# Altium project LASER_DRIVER_LN_HP.PrjPcb (part 4 of 4)

## Sheet ISOLATED_PS.SchDoc: AI ARTIQ Driver
size 420 x 297 mm; Author: G.Kasprowicz; CompanyName: CTI; Organization: CTI; Address1: CTI; Address2: Nowowiejska 15/19 00-665 Warsaw; Address3: gkasprow@gmail.com; DocumentNumber: 5; Revision: 1.0; SheetNumber: 5; SheetTotal: 11; ModifiedBy: -; CheckedDate: -; Title2: ISOLATED PS; DivGrp: CTI; ModifiedDate: -; ProjectName: Sensor Box
Used 2 times, as channels U_ISOLATED_PS_LN, U_ISOLATED_PS_HP. Parts and nets are listed once, with the designators drawn on the sheet.
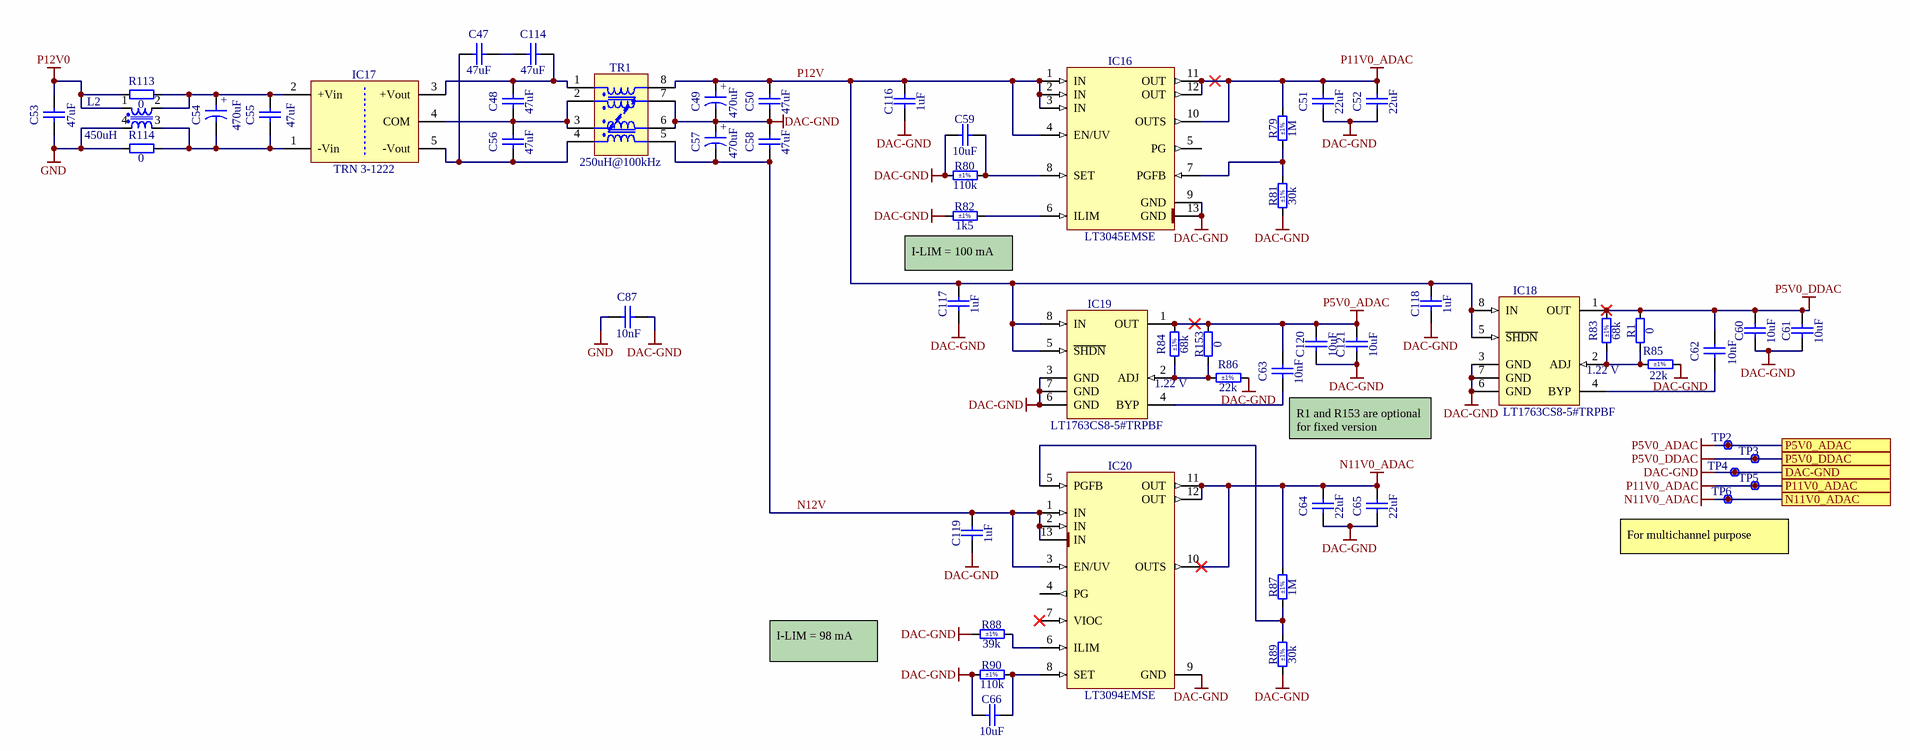
[diagram p9: ISOLATED_PS.SchDoc]

### Parts
C47  47uF  [CAPC3225X270N]
C48  47uF  [CAPC3225X270N]
C49  470uF  [CAPAE1030X1020N]
C50  47uF  [CAPC3225X270N]
C51  22uF  [CAPC3216X180N]
C52  22uF  [CAPC3216X180N]
C53  47uF  [CAPC3225X270N]
C54  470uF  [CAPAE1030X1020N]
C55  47uF  [CAPC3225X270N]
C56  47uF  [CAPC3225X270N]
C57  470uF  [CAPAE1030X1020N]
C58  47uF  [CAPC3225X270N]
C59  10uF  [CAPC2012X135N]
C60  10uF  [CAPC2012X135N]
C61  10uF  [CAPC2012X135N]
C62  10nF  [CAPC1608X87N]
C63  10nF  [CAPC1608X87N]
C64  22uF  [CAPC3216X180N]
C65  22uF  [CAPC3216X180N]
C66  10uF  [CAPC2012X135N]
C87  10nF  [CAPC1608X87N]
C114  47uF  [CAPC3225X270N]
C116  1uF  [CAPC1005X55N]
C117  1uF  [CAPC1005X55N]
C118  1uF  [CAPC1005X55N]
C119  1uF  [CAPC1005X55N]
C120  10uF  [CAPC2012X135N]
C121  10uF  [CAPC2012X135N]
IC16  LT3045EMSE  [SOP65P490X110-13N-R175X294]
IC17  TRN 3-1222  [DCDC_TRACO_TRN3]
IC18  LT1763CS8-5#TRPBF  [SOIC127P600X175-8N]
IC19  LT1763CS8-5#TRPBF  [SOIC127P600X175-8N]
IC20  LT3094EMSE  [SOP65P490X110-13N-R175X294]
L2  450uH  [CMDC-9260-6500]
R1  0  [RESC1608X55N]
R79  1M  Tolerance: ±1%  [RESC1005X40N]
R80  110k  Tolerance: ±1%  [RESC1005X40N]
R81  30k  Tolerance: ±1%  [RESC1005X40N]
R82  1k5  Tolerance: ±1%  [RESC1005X40N]
R83  68k  Tolerance: ±1%  [RESC1608X55N]
R84  68k  Tolerance: ±1%  [RESC1608X55N]
R85  22k  Tolerance: ±1%  [RESC1608X55N]
R86  22k  Tolerance: ±1%  [RESC1608X55N]
R87  1M  Tolerance: ±1%  [RESC1005X40N]
R88  39k  Tolerance: ±1%  [RESC1005X40N]
R89  30k  Tolerance: ±1%  [RESC1005X40N]
R90  110k  Tolerance: ±1%  [RESC1005X40N]
R113  0  [RESC2012X60N]
R114  0  [RESC2012X60N]
R153  0  [RESC1608X55N]
TP2  Test Point  [TPS127]  (value not drawn)  (no BOM)
TP3  Test Point  [TPS127]  (value not drawn)  (no BOM)
TP4  Test Point  [VERO_20-313145]  (value not drawn)
TP5  Test Point  [TPS127]  (value not drawn)  (no BOM)
TP6  Test Point  [TPS127]  (value not drawn)  (no BOM)
TR1  250uH@100kHz  [IND_WURTH_WE-SL_74420]

### Ports
DAC-GND, N11V0_ADAC, P5V0_ADAC, P5V0_DDAC, P11V0_ADAC

### Nets
DAC-GND: C49.2 C50.1 C51.1 C52.1 C57.1 C58.2 C59.1 C60.1 C61.1 C64.1 C65.1 C66.1 C87.2 C116.1 C117.1 C118.1 C119.1 C120.1 C121.1 IC16.9(GND) IC16.13(GND) IC18.3(GND) IC18.6(GND) IC18.7(GND) IC19.3(GND) IC19.6(GND) IC19.7(GND) IC20.9(GND) R80.1 R81.1 R82.1 R85.1 R86.1 R88.1 R89.1 R90.1 TP4.1 TR1.6 TR1.7 ; port DAC-GND
GND: C53.2 C87.1 L2.4 R114.1
N11V0_ADAC: C64.2 C65.2 IC20.10(OUTS) IC20.11(OUT) IC20.12(OUT) R87.2 TP6.1 ; port N11V0_ADAC
P5V0_ADAC: C63.2 C120.2 C121.2 IC19.1(OUT) R84.2 R153.2 TP2.1 ; port P5V0_ADAC
P5V0_DDAC: C60.2 C61.2 C62.2 IC18.1(OUT) R1.2 R83.2 TP3.1 ; port P5V0_DDAC
P11V0_ADAC: C51.2 C52.2 IC16.10(OUTS) IC16.11(OUT) IC16.12(OUT) R79.2 TP5.1 ; port P11V0_ADAC
P12V0: C53.1 L2.1 R113.1
N12V: C57.2 C58.1 C119.2 IC20.1(IN) IC20.2(IN) IC20.3(EN/UV) IC20.13(IN) TR1.5
P12V: C49.1 C50.2 C116.2 C117.2 C118.2 IC16.1(IN) IC16.2(IN) IC16.3(IN) IC16.4(EN/UV) IC18.5(~{SHDN}) IC18.8(IN) IC19.5(~{SHDN}) IC19.8(IN) TR1.8
NetC47_1: C47.1 C56.1 IC17.5(-Vout) TR1.4
NetC47_2: C47.2 C114.1
NetC48_1: C48.1 C56.2 IC17.4(COM) TR1.2 TR1.3
NetC48_2: C48.2 C114.2 IC17.3(+Vout) TR1.1(NC)
NetC54_1: C54.1 C55.1 IC17.2(+Vin) L2.2 R113.2
NetC54_2: C54.2 C55.2 IC17.1(-Vin) L2.3 R114.2
NetC59_2: C59.2 IC16.8(SET) R80.2
NetC62_1: C62.1 IC18.4(BYP)
NetC63_1: C63.1 IC19.4(BYP)
NetC66_2: C66.2 IC20.8(SET) R90.2
NetIC16_6: IC16.6(ILIM) R82.2
NetIC16_7: IC16.7(PGFB) R79.1 R81.2
NetIC18_2: IC18.2(ADJ) R1.1 R83.1 R85.2
NetIC19_2: IC19.2(ADJ) R84.1 R86.2 R153.1
NetIC20_5: IC20.5(PGFB) R87.1 R89.2
NetIC20_6: IC20.6(ILIM) R88.2

Not connected (* = marked no-connect by the designer): IC16 5(PG); IC20 4(PG) 7(VIOC)*

### Channels
U_ISOLATED_PS_LN: designators end in A; ports DAC-GND=DAC-GND N11V0_ADAC=N11V0_ADAC P5V0_ADAC=P5V0_ADAC P5V0_DDAC=P5V0_DDAC P11V0_ADAC=P11V0_ADAC
U_ISOLATED_PS_HP: designators end in B; ports DAC-GND=DAC-GND N11V0_ADAC=N11V0_ADAC P5V0_ADAC=P5V0_ADAC P5V0_DDAC=P5V0_DDAC P11V0_ADAC=P11V0_ADAC

### Notes on the sheet
- I-LIM = 100 mA
- (near IC19) 1.22 V
- (near IC18) 1.22 V
- (near C63) R1 and R153 are optional for fixed version
- For multichannel purpose
- I-LIM = 98 mA
- Project/Equipment
- Document
- Designer
- Drawn by
- Check.by
- Copyright 2018.
  This documentation describes Open Hardware and is licensed under the CERN OHL v.1.1. You may redistribute and modify this documentation under the terms of the CERN OHL v.1.1. (http://ohwr.org/CERNOHL). This documentation is distributed WITHOUT ANY EXPRESS OR IMPLIED WARRANTY, INCLUDING OF MERCHANTABILITY, SATISFACTORY QUALITY AND FITNESS FOR A PARTICULAR PURPOSE. Please see the CERN OHL v.1.1 for applicable conditions.
- Contact
- File
- Last Mod.
- Print Date
- Sheet
- Size
- A3
- of
- Rev
- (in symbol CAE1030-1020_470UF_25V_20%) +

### Library data of the parts
C47 C48 C50 C53 C55 C56 C58 C114 = CC1210_47UF_16V_20%_X5R: Non-polarised capacitor; Part Description: SMD Multilayer Chip Ceramic Capacitor; Manufacturer: GENERIC; Manufacturer1 Part Number: EMK325BJ476MM-T; Voltage: 16V; TC: X5R; Tolerance: ±20%; Part Number: CC1210_47UF_16V_20%_X5R; Component Kind: Standard; Component Type: Standard; Pin Count: 2; Value: 47uF; Status: None; Manufacturer Part Number: CC1210_47UF_16V_20%_X5R; Case: 1210; Mounted: Yes; Socket: No; SMD: Yes; Sense: No; Manufacturer1 Example: TAIYO YUDEN; Manufacturer1 ComponentHeight: 2.7mm; HelpURL: \\cern.ch\dfs\Applications\Altium\Datasheets\CC1210_X5R_TAIYO-YUDEN_HIGH-VALUE.pdf; Author: CERN DEM MR; CreateDate: 03.02.2016; LatestRevisionDate: 03.02.2016
C49 C54 C57 = CAE1030-1020_470UF_25V_20%: Polarised capacitor; Part Description: Aluminum Electrolytic SMT Capacitor; Manufacturer: PANASONIC; Manufacturer Part Number: EEEFK1E471AP; Voltage: 25V; Tolerance: ±20%; Part Number: CAE1030-1020_470UF_25V_20%; Component Kind: Standard; Component Type: Standard; Pin Count: 2; Value: 470uF; Status: Not Recommended; Case: G; Mounted: Yes; Socket: No; SMD: Yes; Sense: No; ComponentHeight: 10.2mm; HelpURL: \\cern.ch\dfs\Applications\Altium\Datasheets\CAE_PANASONIC_FK-V.pdf; Author: CERN DEM JLC; CreateDate: 03.12.2007; LatestRevisionDate: 05.11.2014
C51 C52 C64 C65 = CC1206_22UF_35V_20%_JB_TDK_C3216JB1V226M160AC: Non-polarised capacitor; Part Description: SMD Multilayer Chip Ceramic Capacitor; Manufacturer: TDK; Voltage: 35V; TC: JB(±10%); Tolerance: ±20%; Part Number: CC1206_22UF_35V_20%_JB_TDK_C3216JB1V226M160AC; Component Kind: Standard; Component Type: Standard; Pin Count: 2; Value: 22uF; Status: None; Manufacturer Part Number: C3216JB1V226M160AC; Case: 1206; Mounted: Yes; Socket: No; SMD: Yes; Sense: No; ComponentHeight: 1.8mm; HelpURL: \\cern.ch\dfs\Applications\Altium\Datasheets\CC1206_TDK_C3216JB1V226M160AC.pdf; Author: CERN DEM JLC; CreateDate: 13.07.2017; LatestRevisionDate: 13.07.2017
C59-C61 C66 C120 C121 = CC0805_10UF_16V_10%_X5R: Non-polarised capacitor; Part Description: SMD Multilayer Chip Ceramic Capacitor; Manufacturer: GENERIC; Manufacturer1 Part Number: C0805C106K4PAC; Voltage: 16V; TC: X5R; Tolerance: ±10%; Part Number: CC0805_10UF_16V_10%_X5R; Component Kind: Standard; Component Type: Standard; Pin Count: 2; Value: 10uF; Status: Preferred; Manufacturer Part Number: CC0805_10UF_16V_10%_X5R; Case: 0805; Mounted: Yes; Socket: No; SMD: Yes; Sense: No; Manufacturer1 Example: KEMET; Manufacturer1 ComponentHeight: 1.4mm; HelpURL: \\cern.ch\dfs\Applications\Altium\Datasheets\CC1206_X5R_KEMET.pdf; Author: CERN DEM JLC; CreateDate: 03.12.2007; LatestRevisionDate: 03.12.2007
C62 C63 C87 = CC0603_10NF_50V_5%_C0G: Non-polarised capacitor; Part Description: SMD Multilayer Chip Ceramic Capacitor; Manufacturer: GENERIC; Manufacturer1 Part Number: C1608C0G1H103J080AA; Voltage: 50V; TC: C0G/NP0; Tolerance: ±5%; Part Number: CC0603_10NF_50V_5%_C0G; Component Kind: Standard; Component Type: Standard; Pin Count: 2; Value: 10nF; Status: Preferred; Manufacturer Part Number: CC0603_10NF_50V_5%_C0G; Case: 0603; Mounted: Yes; Socket: No; SMD: Yes; Sense: No; Manufacturer1 Example: TDK; Manufacturer1 ComponentHeight: 0.9mm; HelpURL: \\cern.ch\dfs\Applications\Altium\Datasheets\CC0603_C0G_TDK_C.pdf; Author: CERN DEM JLC; CreateDate: 10.12.2014; LatestRevisionDate: 10.12.2014
C116-C119 = CC0402_1UF_16V_10%_X5R: Non-polarised capacitor; Part Description: SMD Multilayer Chip Ceramic Capacitor; Manufacturer: GENERIC; Manufacturer1 Part Number: C1005X5R1C105KT; Voltage: 16V; TC: X5R; Tolerance: ±10%; Part Number: CC0402_1UF_16V_10%_X5R; Component Kind: Standard; Component Type: Standard; Pin Count: 2; Value: 1uF; Status: Preferred; Manufacturer Part Number: CC0402_1UF_16V_10%_X5R; Case: 0402; Mounted: Yes; Socket: No; SMD: Yes; Sense: No; Manufacturer1 Example: TDK; Manufacturer1 ComponentHeight: 0.55mm; HelpURL: \\cern.ch\dfs\Applications\Altium\Datasheets\CC0402_X5R_TDK_C.pdf; Author: CERN DEM JLC; CreateDate: 25.10.2012; LatestRevisionDate: 25.10.2012
IC16 = LT3045EMSE: 20V, 500mA, Ultralow Noise, Ultrahigh PSRR Linear Regulator; Manufacturer: LINEAR TECHNOLOGY; PressFit: No; Bonding: No; Part Number: LT3045EMSE; Component Kind: Standard; Component Type: Standard; Device: LT3045EMSE; PackageDescription: SOP, 0.65mm Pitch; 12 Pin, 3.00mm W X 4.039mm L X 1.10mm H body (w/Thermal Tab 1.75 X 2.94 mm), IPC Medium Density; Part Description: 20V, 500mA, Ultralow Noise, Ultrahigh PSRR Linear Regulator; Manufacturer Part Number: LT3045EMSE; Pin Count: 13; Case: MSOP12; Mounted: Yes; Socket: No; SMD: Yes; Sense: No; ComponentHeight: 1.1mm; HelpURL: \\cern.ch\dfs\Applications\Altium\Datasheets\LT3045.pdf; Author: CERN DEM HF; CreateDate: 18.05.2022; LatestRevisionDate: 18.05.2022
IC17 = TRN 3-1222: TRACO, TRN 3 Serie, Dual Output DCDC Converter; Part Description: 9-18VDC to ±12V, Iout (max) ±125mA, 3W DC-DC Converter; Manufacturer: TRACO POWER; PressFit: No; Bonding: No; Part Number: TRN 3-1222; Component Kind: Standard; Component Type: Standard; Device: TRN 3-1222; PackageDescription: TRN 3 Series , Body 11.9 x 7.7mm; Manufacturer Part Number: TRN 3-1222; Pin Count: 5; Mounted: Yes; Socket: No; SMD: No; Sense: No; ComponentHeight: 11.5mm; HelpURL: \\cern.ch\dfs\Applications\Altium\Datasheets\TRN 3-1222.pdf; Author: CERN DEM JLC; CreateDate: 06.06.2017; LatestRevisionDate: 06.06.2017
IC18 IC19 = LT1763CS8: 1.22V to 20V 500mA, Low Noise, LDO Adjustable Micropower Regulator; Part Description: 1.22V to 20V, 500mA, Low Noise, LDO Adjustable Micropower Regulator; Manufacturer: LINEAR TECHNOLOGY; PressFit: No; Bonding: No; Part Number: LT1763CS8; Component Kind: Standard; Component Type: Standard; Device: LT1763CS8; PackageDescription: SOIC 8, Pitch 1.27mm, Body 4x5mm, IPC Medium Density; Manufacturer Part Number: LT1763CS8; Pin Count: 8; Case: SOIC8; Mounted: Yes; Socket: No; SMD: Yes; Sense: No; ComponentHeight: 1.75mm; HelpURL: \\cern.ch\dfs\Applications\Altium\Datasheets\LT1763CS8#PBF.pdf; Author: CERN DEM JLC; CreateDate: 11.01.2010; LatestRevisionDate: 16.03.2021
IC20 = LT3094EMSE#PBF: -20V, 500mA, Ultralow Noise, Ultrahigh PSRR Negative Linear Regulator; Manufacturer: LINEAR TECHNOLOGY; PressFit: No; Bonding: No; Part Number: LT3094EMSE#PBF; Component Kind: Standard; Component Type: Standard; Device: LT3094EMSE; PackageDescription: SOP, 0.65mm Pitch; 12 Pin, 3.00mm W X 4.039mm L X 1.10mm H body (w/Thermal Tab 1.75 X 2.94 mm), IPC Medium Density; Part Description: -20V, 500mA, Ultralow Noise, Ultrahigh PSRR Negative Linear Regulator; Manufacturer Part Number: LT3094EMSE#PBF; Pin Count: 13; Case: MSOP12; Mounted: Yes; Socket: No; SMD: Yes; Sense: No; ComponentHeight: 1.1mm; HelpURL: \\cern.ch\dfs\Applications\Altium\Datasheets\LT3094EMSE#PBF.pdf; Author: CERN DEM JLC; CreateDate: 12.11.2018; LatestRevisionDate: 12.11.2018
L2 = IND_450UH_35%_TRACO_TCK-048: Inductor Common Mode; Part Description: Common Mode Choke TCK-048; Manufacturer: TRACO POWER; Power: 5.2A; Resistance: 0.025R; Tolerance: ±35%; Part Number: IND_450UH_35%_TRACO_TCK-048; Component Kind: Standard; Component Type: Standard; Footprint: IND_TRACO_TCK-048; Pin Count: 4; Value: 450uH; Manufacturer Part Number: TCK-048; Mounted: Yes; Socket: No; SMD: No; Sense: No; ComponentHeight: 9.8mm; HelpURL: \\cern.ch\dfs\Applications\Altium\Datasheets\IND_TRACO_TCK-048.pdf; Author: CERN DEM MR; CreateDate: 28.01.2016; LatestRevisionDate: 03.10.2019
R1 R153 = R0603_0R_JUMPER: Resistor; Part Description: 1A (0.05R Max DC Resistance) Zero Ohm Jumper; Manufacturer: GENERIC; Manufacturer1 Part Number: NRC06Z0; PressFit: No; Part Number: R0603_0R_JUMPER; Component Kind: Standard; Component Type: Standard; Pin Count: 2; Value: 0; Status: Preferred; Manufacturer Part Number: R0603_0R_JUMPER; Case: 0603; Mounted: Yes; Sense: No; Socket: No; SMD: Yes; Manufacturer1 Example: NIC COMPONENT; Manufacturer1 ComponentHeight: 0.55mm; HelpURL: \\cern.ch\dfs\Applications\Altium\Datasheets\R0603_NIC_NRC.pdf; Author: CERN DEM JLC; CreateDate: 03.12.2007; LatestRevisionDate: 13.03.2008
R79 R87 = R0402_1M_1%_0.0625W_100PPM: Resistor - 1%; Part Description: General Purpose Thick Film Chip Resistor; Manufacturer: GENERIC; Manufacturer1 Part Number: 232270671005L; TC: ±100ppm/°C; PressFit: No; Part Number: R0402_1M_1%_0.0625W_100PPM; Component Kind: Standard; Component Type: Standard; Pin Count: 2; Value: 1M; Status: Not Recommended; Power: 0.0625W; Manufacturer Part Number: R0402_1M_1%_0.0625W_100PPM; Case: 0402; Mounted: Yes; Sense: No; Socket: No; SMD: Yes; Manufacturer1 Example: YAGEO PHYCOMP; Manufacturer1 ComponentHeight: 0.4mm; HelpURL: \\cern.ch\dfs\Applications\Altium\Datasheets\R0402_Phycomp_RC0402.pdf; Author: CERN DEM JLC; CreateDate: 03.12.2007; LatestRevisionDate: 17.10.2012
R80 R90 = R0402_110K_1%_0.0625W_100PPM: Resistor - 1%; Part Description: General Purpose Thick Film Chip Resistor; Manufacturer: GENERIC; Manufacturer1 Part Number: 232270671104L; TC: ±100ppm/°C; PressFit: No; Part Number: R0402_110K_1%_0.0625W_100PPM; Component Kind: Standard; Component Type: Standard; Pin Count: 2; Value: 110k; Status: Not Recommended; Power: 0.0625W; Manufacturer Part Number: R0402_110K_1%_0.0625W_100PPM; Case: 0402; Mounted: Yes; Sense: No; Socket: No; SMD: Yes; Manufacturer1 Example: YAGEO PHYCOMP; Manufacturer1 ComponentHeight: 0.4mm; HelpURL: \\cern.ch\dfs\Applications\Altium\Datasheets\R0402_Phycomp_RC0402.pdf; Author: CERN DEM JLC; CreateDate: 03.12.2007; LatestRevisionDate: 17.10.2012
R81 R89 = R0402_30K_1%_0.0625W_100PPM: Resistor - 1%; Part Description: General Purpose Thick Film Chip Resistor; Manufacturer: GENERIC; Manufacturer1 Part Number: 232270673003L; TC: ±100ppm/°C; PressFit: No; Part Number: R0402_30K_1%_0.0625W_100PPM; Component Kind: Standard; Component Type: Standard; Pin Count: 2; Value: 30k; Status: Not Recommended; Power: 0.0625W; Manufacturer Part Number: R0402_30K_1%_0.0625W_100PPM; Case: 0402; Mounted: Yes; Sense: No; Socket: No; SMD: Yes; Manufacturer1 Example: YAGEO PHYCOMP; Manufacturer1 ComponentHeight: 0.4mm; HelpURL: \\cern.ch\dfs\Applications\Altium\Datasheets\R0402_Phycomp_RC0402.pdf; Author: CERN DEM JLC; CreateDate: 03.12.2007; LatestRevisionDate: 17.10.2012
R82 = R0402_1K5_1%_0.0625W_100PPM: Resistor - 1%; Part Description: General Purpose Thick Film Chip Resistor; Manufacturer: GENERIC; Manufacturer1 Part Number: 232270671502L; TC: ±100ppm/°C; PressFit: No; Part Number: R0402_1K5_1%_0.0625W_100PPM; Component Kind: Standard; Component Type: Standard; Pin Count: 2; Value: 1k5; Status: Not Recommended; Power: 0.0625W; Manufacturer Part Number: R0402_1K5_1%_0.0625W_100PPM; Case: 0402; Mounted: Yes; Sense: No; Socket: No; SMD: Yes; Manufacturer1 Example: YAGEO PHYCOMP; Manufacturer1 ComponentHeight: 0.4mm; HelpURL: \\cern.ch\dfs\Applications\Altium\Datasheets\R0402_Phycomp_RC0402.pdf; Author: CERN DEM JLC; CreateDate: 03.12.2007; LatestRevisionDate: 17.10.2012
R83 R84 = R0603_68K_1%_0.1W_100PPM: Resistor - 1%; Part Description: General Purpose Thick Film Chip Resistor; Manufacturer: GENERIC; Manufacturer1 Part Number: NRC06F6802TRF; Power: 0.1W; TC: ±100ppm/°C; PressFit: No; Part Number: R0603_68K_1%_0.1W_100PPM; Component Kind: Standard; Component Type: Standard; Pin Count: 2; Value: 68k; Status: Preferred; Manufacturer Part Number: R0603_68K_1%_0.1W_100PPM; Case: 0603; Mounted: Yes; Sense: No; Socket: No; SMD: Yes; Manufacturer1 Example: NIC COMPONENT; Manufacturer1 ComponentHeight: 0.55mm; HelpURL: \\cern.ch\dfs\Applications\Altium\Datasheets\R0603_NIC_NRC.pdf; Author: CERN DEM JLC; CreateDate: 03.12.2007; LatestRevisionDate: 13.03.2008
R85 R86 = R0603_22K_1%_0.1W_100PPM: Resistor - 1%; Part Description: General Purpose Thick Film Chip Resistor; Manufacturer: GENERIC; Manufacturer1 Part Number: NRC06F2202TRF; Power: 0.1W; TC: ±100ppm/°C; PressFit: No; Part Number: R0603_22K_1%_0.1W_100PPM; Component Kind: Standard; Component Type: Standard; Pin Count: 2; Value: 22k; Status: Preferred; Manufacturer Part Number: R0603_22K_1%_0.1W_100PPM; Case: 0603; Mounted: Yes; Sense: No; Socket: No; SMD: Yes; Manufacturer1 Example: NIC COMPONENT; Manufacturer1 ComponentHeight: 0.55mm; HelpURL: \\cern.ch\dfs\Applications\Altium\Datasheets\R0603_NIC_NRC.pdf; Author: CERN DEM JLC; CreateDate: 03.12.2007; LatestRevisionDate: 13.03.2008
R88 = R0402_39K_1%_0.0625W_100PPM: Resistor - 1%; Part Description: General Purpose Thick Film Chip Resistor; Manufacturer: GENERIC; Manufacturer1 Part Number: 232270673903; TC: ±100ppm/°C; PressFit: No; Part Number: R0402_39K_1%_0.0625W_100PPM; Component Kind: Standard; Component Type: Standard; Pin Count: 2; Value: 39k; Status: Not Recommended; Power: 0.0625W; Manufacturer Part Number: R0402_39K_1%_0.0625W_100PPM; Case: 0402; Mounted: Yes; Sense: No; Socket: No; SMD: Yes; Manufacturer1 Example: YAGEO PHYCOMP; Manufacturer1 ComponentHeight: 0.4mm; HelpURL: \\cern.ch\dfs\Applications\Altium\Datasheets\R0402_Phycomp_RC0402.pdf; Author: CERN DEM JLC; CreateDate: 03.12.2007; LatestRevisionDate: 17.10.2012
R113 R114 = R0805_0R_JUMPER: Resistor; Part Description: 2A (0.05R Max DC Resistance) Zero Ohm Jumper; Manufacturer: GENERIC; Manufacturer1 Part Number: NRC10Z0; PressFit: No; Part Number: R0805_0R_JUMPER; Component Kind: Standard; Component Type: Standard; Pin Count: 2; Value: 0; Status: Preferred; Manufacturer Part Number: R0805_0R_JUMPER; Case: 0805; Mounted: Yes; Sense: No; Socket: No; SMD: Yes; Manufacturer1 Example: NIC COMPONENT; Manufacturer1 ComponentHeight: 0.6mm; HelpURL: \\cern.ch\dfs\Applications\Altium\Datasheets\R0805_NIC_NRC.pdf; Author: CERN DEM JLC; CreateDate: 03.12.2007; LatestRevisionDate: 13.03.2008
TP2 TP3 TP5 TP6 = SMD_PAD_1.27X1.27MM: as TP7-TP9 on sheet Diagnostics; Part Number: SMD_PAD_1.27X1.27MM; Component Type: Standard (No BOM); Pin Count: 1; Family: Test Point; Socket: No; SMD: No; Sense: No; Status: None; ComponentHeight: 0mm; HelpURL: Undefined; Author: CERN DEM JLC; CreateDate: 12.01.2008; LatestRevisionDate: 12.01.2008; PackageDescription: 1.27mm x 1.27mm PCB Copper Area (SMD Test Point)
TP4 = VERO_20-313145: Part Description: Black Bead PCB Terminal Test Pin for 2.4mm PCB Thickness (1.32mm Hole); Manufacturer: VERO TECHNOLOGIES; PressFit: No; Part Number: VERO_20-313145; Component Kind: Standard; Component Type: Standard; Pin Count: 1; Family: Test Point; Mounted: Yes; Socket: No; SMD: No; Sense: No; Status: None; Manufacturer Part Number: 20-313145; ComponentHeight: 5.3mm; HelpURL: \\cern.ch\dfs\Applications\Altium\Datasheets\VERO_20-313145.pdf; Author: CERN DEM JLC; CreateDate: 15.07.2013; LatestRevisionDate: 15.07.2013
TR1 = IND_250UH_35%_WURTH_WE-SL_744204: Flyback Transformer; Part Description: 4 Line Common Mode Choke Surface Mount 600mA DCR(WE-SL Series); Manufacturer: WURTH ELEKTRONIK; Manufacturer Part Number: 744204; Power: 600mA; Resistance: 0.12r; Tolerance: ±35%; Part Number: IND_250UH_35%_WURTH_WE-SL_744204; Component Kind: Standard; Component Type: Standard; Pin Count: 8; Value: 250uH@100kHz; Mounted: Yes; Socket: No; SMD: Yes; Sense: No; ComponentHeight: 5.7mm; HelpURL: \\cern.ch\dfs\Applications\Altium\Datasheets\WURTH_WE-SL_74420.pdf; Author: CERN DEM HF; CreateDate: 16.05.2022; LatestRevisionDate: 16.05.2022

## Sheet FOLLOWER_DIVIDER.SchDoc: AI ARTIQ Driver
size 420 x 297 mm; Author: G.Kasprowicz; CompanyName: CTI; Organization: CTI; Address1: CTI; Address2: Nowowiejska 15/19 00-665 Warsaw; Address3: gkasprow@gmail.com; DocumentNumber: 11; Revision: 1.0; SheetNumber: 11; SheetTotal: 11; ModifiedBy: -; CheckedDate: -; Title2: FOLLOWER DIVIDER; DivGrp: CTI; ModifiedDate: -; ProjectName: Sensor Box
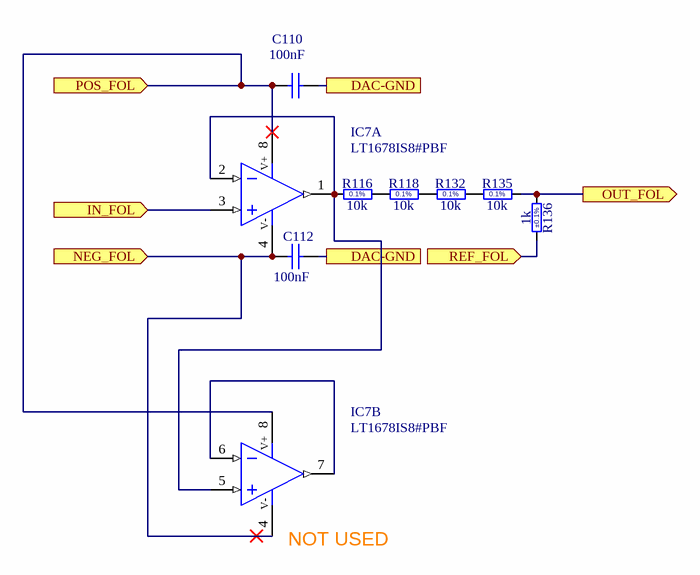
[diagram p10: FOLLOWER_DIVIDER.SchDoc]

### Parts
C110  100nF  [CAPC1608X87N]
C112  100nF  [CAPC1608X87N]
IC7  LT1678IS8#PBF  [SOIC127P600X175-8N]  (parts A,B of 2)
R116  10k  [RESC1608X55N]
R118  10k  [RESC1608X55N]
R132  10k  [RESC1608X55N]
R135  10k  [RESC1608X55N]
R136  1k  Tolerance: ±0.1%  [RESC1608X64N]

### Ports
DAC-GND, IN_FOL (in), NEG_FOL (in), OUT_FOL (out), POS_FOL (in), REF_FOL (in)

### Nets
DAC-GND: C110.2 C112.2 ; port DAC-GND
N11V0_ADAC: C112.1 IC7.4(V-) ; port NEG_FOL
P11V0_ADAC: C110.1 IC7.8(V+) ; port POS_FOL
NetIC7_1: IC7.1(OUT) IC7.2(IN-) IC7.5(IN+) R116.1
NetIC7_3: IC7.3(IN+) ; port IN_FOL
NetIC7_6: IC7.6(IN-) IC7.7(OUT)
NetR45_1: R135.2 R136.1 ; port OUT_FOL
NetR116_2: R116.2 R118.1
NetR118_2: R118.2 R132.1
NetR132_2: R132.2 R135.1
NetR136_2: R136.2 ; port REF_FOL

### Notes on the sheet
- (near IC7) NOT USED
- Project/Equipment
- Document
- Designer
- Drawn by
- Check.by
- Copyright 2018.
  This documentation describes Open Hardware and is licensed under the CERN OHL v.1.1. You may redistribute and modify this documentation under the terms of the CERN OHL v.1.1. (http://ohwr.org/CERNOHL). This documentation is distributed WITHOUT ANY EXPRESS OR IMPLIED WARRANTY, INCLUDING OF MERCHANTABILITY, SATISFACTORY QUALITY AND FITNESS FOR A PARTICULAR PURPOSE. Please see the CERN OHL v.1.1 for applicable conditions.
- Contact
- File
- Last Mod.
- Print Date
- Sheet
- Size
- A3
- of
- Rev
- (in symbol R0603_10K_0.1%_0.063W_10PPM) 0.1%

### Library data of the parts
C110 C112 = CC0603_100NF_50V_10%_X7R: Non-polarised capacitor; Part Description: SMD Multilayer Chip Ceramic Capacitor; Manufacturer: GENERIC; Manufacturer1 Part Number: 223858615649; Voltage: 50V; TC: X7R; Tolerance: ±10%; Part Number: CC0603_100NF_50V_10%_X7R; Component Kind: Standard; Component Type: Standard; Pin Count: 2; Value: 100nF; Status: Preferred; Manufacturer Part Number: CC0603_100NF_50V_10%_X7R; Case: 0603; Mounted: Yes; Socket: No; SMD: Yes; Sense: No; Manufacturer1 Example: PHYCOMP; Manufacturer1 ComponentHeight: 0.87mm; HelpURL: \\cern.ch\dfs\Applications\Altium\Datasheets\CC0603_X7R_PHYCOMP.pdf; Author: CERN DEM JLC; CreateDate: 03.12.2007; LatestRevisionDate: 03.12.2007
IC7 = LT1678IS8#PBF: Dual Operational Amplifier; Part Description: Dual Low Noise, Rail-to-Rail, Precision Operational Amplifier; Manufacturer: LINEAR TECHNOLOGY; PressFit: No; Bonding: No; Part Number: LT1678IS8#PBF; Component Kind: Standard; Component Type: Standard; Device: LT1678IS8#PBF; PackageDescription: SOIC 8, Pitch 1.27mm - Body 4x5mm, IPC Medium Density; Manufacturer Part Number: LT1678IS8#PBF; Pin Count: 8; Case: SOIC8; Mounted: Yes; Socket: No; SMD: Yes; Sense: No; ComponentHeight: 1.75mm; Author: CERN DEM JLC; HelpURL: \\cern.ch\dfs\Applications\Altium\Datasheets\LT1678IS8#PBF.pdf; CreateDate: 09.07.2014; LatestRevisionDate: 09.07.2014
R116 R118 R132 R135 = R0603_10K_0.1%_0.063W_10PPM: Resistor - 0.1%; Part Description: Thin Film Chip Resistor; Manufacturer: GENERIC; Manufacturer1 Part Number: RN73C1J10KBTDF; Power: 0.063W; TC: ±10ppm; PressFit: No; Part Number: R0603_10K_0.1%_0.063W_10PPM; Component Kind: Standard; Component Type: Standard; Pin Count: 2; Value: 10k; Status: Not Recommended; Tolerance: ±0.1%; Manufacturer Part Number: R0603_10K_0.1%_0.063W_10PPM; Case: 0603; Mounted: Yes; Sense: No; Socket: No; SMD: Yes; Manufacturer1 Example: TYCO HOLSWORTHY; Manufacturer1 ComponentHeight: 0.5mm; HelpURL: \\cern.ch\dfs\Applications\Altium\Datasheets\R0603_Tyco_RN73.pdf; Author: CERN DEM JLC; CreateDate: 03.12.2007; LatestRevisionDate: 13.03.2008
R136 = R0603_1K_0.1%_0.1W_25PPM: Resistor - 0.1%; Part Description: Thin Film Chip Resistor; Manufacturer: GENERIC; Manufacturer1 Part Number: ERA3AEB102V; Power: 0.1W; TC: ±25ppm/°C; PressFit: No; Part Number: R0603_1K_0.1%_0.1W_25PPM; Component Kind: Standard; Component Type: Standard; Pin Count: 2; Value: 1k; Status: Not Recommended; Manufacturer Part Number: R0603_1K_0.1%_0.1W_25PPM; Case: 0603; Mounted: Yes; Sense: No; Socket: No; SMD: Yes; Manufacturer1 Example: PANASONIC; Manufacturer1 ComponentHeight: 0.55mm; HelpURL: \\cern.ch\dfs\Applications\Altium\Datasheets\R0603_PANASONIC_ERA.pdf; Author: CERN DEM JLC; CreateDate: 11.01.2017; LatestRevisionDate: 11.01.2017

## Nets that join several sheets
DAC-GND: U_DAC_LN (43 pins), U_DAC_HP (43 pins), U_ISOLATED_PS_LN (39 pins), U_ISOLATED_PS_HP (39 pins), FOLLOWER_DIVIDER (C110.2 C112.2)
GND: AI_ARTIQ_Driver (7 pins), U_output_stage_LN (14 pins), U_DAC_LN (7 pins), connectors (57 pins), AFE_conn (10 pins), I2C (5 pins), Diagnostics (16 pins), U_output_stage_HP (14 pins), U_DAC_HP (7 pins), LN_LASER_PS (39 pins), HP_LASER_PS (C90.1 C96.2 L8.4), U_ISOLATED_PS_LN (C53A.2 C87A.1 L2A.4 R114A.1), U_ISOLATED_PS_HP (C53B.2 C87B.1 L2B.4 R114B.1)
N11V0_ADAC: U_DAC_LN (R19A.1 R31A.2), U_DAC_HP (R19B.1 R31B.2), U_ISOLATED_PS_LN (7 pins), U_ISOLATED_PS_HP (7 pins), FOLLOWER_DIVIDER (C112.1 IC7.4)
N12V0AS: connectors (J6.16), AFE_conn (F2.1)
N14V5_LASER: AI_ARTIQ_Driver (J2.13), U_output_stage_LN (14 pins), Diagnostics (D9.1), LN_LASER_PS (6 pins)
P3V3s: AI_ARTIQ_Driver (J2.18), U_output_stage_LN (C125A.2 IC26A.5), U_DAC_LN (R16A.2 R22A.2), connectors (13 pins), AFE_conn (F3.1), I2C (L7.1 R163.2), Diagnostics (R13.2 R66.2 R162.2), U_output_stage_HP (C125B.2 IC26B.5), U_DAC_HP (R16B.2 R22B.2)
P5V0_ADAC: U_DAC_LN (R21A.1), U_DAC_HP (R21B.1), U_ISOLATED_PS_LN (7 pins), U_ISOLATED_PS_HP (7 pins)
P5V0_DDAC: U_DAC_LN (R17A.2 R20A.2 R23A.2 R110A.2), U_DAC_HP (R17B.2 R20B.2 R23B.2 R110B.2), U_ISOLATED_PS_LN (7 pins), U_ISOLATED_PS_HP (7 pins)
P11V0_ADAC: U_DAC_LN (R18A.1 R27A.2 R28A.1), U_DAC_HP (R18B.1 R27B.2 R28B.1), U_ISOLATED_PS_LN (7 pins), U_ISOLATED_PS_HP (7 pins), FOLLOWER_DIVIDER (C110.1 IC7.8)
P12V0: AI_ARTIQ_Driver (J2.14), connectors (J10.31 J10.32 J10.33 TP13.1), Diagnostics (R52.2 R156.2), LN_LASER_PS (10 pins), HP_LASER_PS (C90.2 C96.1 L8.1), U_ISOLATED_PS_LN (C53A.1 L2A.1 R113A.1), U_ISOLATED_PS_HP (C53B.1 L2B.1 R113B.1)
P12V0AS: connectors (J6.15), AFE_conn (F1.1)
P14V5_LASER: AI_ARTIQ_Driver (J2.3), U_output_stage_LN (14 pins), Diagnostics (D6.3), LN_LASER_PS (6 pins)
ADC_0_N: AI_ARTIQ_Driver (J2.12), connectors (J6.3)
ADC_0_P: AI_ARTIQ_Driver (J2.10), connectors (J6.2)
CS_OUT: AI_ARTIQ_Driver (J2.4 J2.6), Diagnostics (R117.1), U_output_stage_HP (6 pins)
CS_OUT: AI_ARTIQ_Driver (J2.7), U_output_stage_LN (6 pins), Diagnostics (R139.1)
CURR_MON_HP: connectors (J1.13), U_output_stage_HP (R130B.2 TP1B.1)
CURR_MON_LN: U_output_stage_LN (R130A.2 TP1A.1), connectors (J1.16)
I2C1_SCL: AI_ARTIQ_Driver (J2.15), connectors (5 pins), I2C (IC1.2)
I2C1_SDA: AI_ARTIQ_Driver (J2.16), connectors (5 pins), I2C (IC1.1)
JADC1_IN2_P: connectors (J1.1), Diagnostics (C92.2 R49.2 R50.2 TP7.1)
JADC3_IN5_P: connectors (J1.7), Diagnostics (C10.2 R68.2 R115.2 TP8.1)
LD_RTN: AI_ARTIQ_Driver (J2.9), U_output_stage_LN (J4A.2 J5A.5 R15A.2)
MCU_Interlock: AI_ARTIQ_Driver (J2.19), connectors (R124.2 R161.2)
Neg: AI_ARTIQ_Driver (R76.1 R77.2), U_output_stage_HP (14 pins)
NetC37A_1: AI_ARTIQ_Driver (R37.2 R39.2), U_output_stage_LN (C37A.1 IC15A.3)
NetC37B_1: AI_ARTIQ_Driver (R45.2 R47.2), U_output_stage_HP (C37B.1 IC15B.3)
NetC42A_2: AI_ARTIQ_Driver (R36.1 R38.2), U_output_stage_LN (C42A.2 IC15A.5)
NetC42B_2: AI_ARTIQ_Driver (R44.1 R46.2), U_output_stage_HP (C42B.2 IC15B.5)
NetC106_2: AI_ARTIQ_Driver (R77.1), HP_LASER_PS (7 pins)
NetC107_1: AI_ARTIQ_Driver (R73.1), HP_LASER_PS (C107.1 C111.2 L14.2)
NetIC7_3: U_DAC_HP (IC11B.7 TP15B.1), FOLLOWER_DIVIDER (IC7.3)
NetIC11A_7: AI_ARTIQ_Driver (R37.1 R38.1), U_DAC_LN (IC11A.7 TP15A.1)
NetIC12A_4: U_DAC_LN (IC12A.4), connectors (R7.2), U_DAC_HP (IC12B.4)
NetIC12A_5: U_DAC_LN (IC12A.5), connectors (R8.2), U_DAC_HP (IC12B.5)
NetIC12A_6: U_DAC_LN (IC12A.6), connectors (R12.2)
NetIC12B_6: connectors (R2.2), U_DAC_HP (IC12B.6)
NetNT1A_1: AI_ARTIQ_Driver (R35.2 R39.1), U_output_stage_LN (NT1A.1)
NetNT1B_1: AI_ARTIQ_Driver (R43.2 R47.1), U_output_stage_HP (NT1B.1)
NetNT9A_1: AI_ARTIQ_Driver (R36.2 R40.2), U_output_stage_LN (NT9A.1)
NetNT9B_1: AI_ARTIQ_Driver (R44.2 R48.2), U_output_stage_HP (NT9B.1)
NetR45_1: AI_ARTIQ_Driver (R45.1 R46.1), FOLLOWER_DIVIDER (R135.2 R136.1)
NetR136_2: AI_ARTIQ_Driver (R137.1 R138.2), FOLLOWER_DIVIDER (R136.2)
PA0/UART4_TX: connectors (J10.18 R123.1), U_DAC_HP (IC10B.3)
PC2_ADC3_N: connectors (R11.2), AFE_conn (J3.18)
PC3_ADC3_P: connectors (R10.2), AFE_conn (J3.16)
Pos: AI_ARTIQ_Driver (R73.2 R78.1), U_output_stage_HP (14 pins)
QSPI_CLK_N: connectors (IC2.3), AFE_conn (J3.17)
QSPI_CLK_P: connectors (IC2.4), AFE_conn (J3.15)
QSPI_IO0_N: connectors (IC9.3 R159.1), AFE_conn (J3.11)
QSPI_IO0_P: connectors (IC9.4 R159.2), AFE_conn (J3.9)
QSPI_IO1_N: connectors (IC3.3 R4.1), AFE_conn (J3.5)
QSPI_IO1_P: connectors (IC3.4 R4.2), AFE_conn (J3.3)
QSPI_NCS_N: connectors (IC5.3), AFE_conn (J3.12)
QSPI_NCS_P: connectors (IC5.4), AFE_conn (J3.10)
REF_N5V0: AI_ARTIQ_Driver (R48.1 R138.1), U_DAC_HP (6 pins)
REF_N5V0: AI_ARTIQ_Driver (R40.1), U_DAC_LN (6 pins)
REF_P5V0: AI_ARTIQ_Driver (R43.1 R137.2), U_DAC_HP (6 pins)
REF_P5V0: AI_ARTIQ_Driver (R35.1), U_DAC_LN (6 pins)
RTN: AI_ARTIQ_Driver (J2.5), U_output_stage_HP (J4B.2 J5B.5 R15B.2)
SPI1_MISO: U_DAC_LN (IC10A.6), connectors (J10.21), U_DAC_HP (IC10B.6)
SPI1_MOSI: U_DAC_LN (IC10A.5), connectors (J10.20 R121.1 R141.2), U_DAC_HP (IC10B.5)
SPI1_NSS: U_DAC_LN (IC10A.3), connectors (J10.23 R122.1)
SPI1_SCK: U_DAC_LN (IC10A.4), connectors (J10.24 R120.1 R142.2), U_DAC_HP (IC10B.4)
TEMP: AI_ARTIQ_Driver (J2.1), I2C (IC1.3 R163.1), Diagnostics (T19.1)

## Assembly variants
LNsoHPso: not fitted C88 C95 C102 C103 C115 C122 C128A C128B C129A C129B D12A D12B IC27A IC27B IC30 R5 R38 R39 R40 R46 R47 R48 R65 R70 R71 R72 R77 R78 R83A R83B R84A R84B R85A R85B R86A R86B R112 R120 R121 R122 R123 R131A R131B R138 R146A R146B R147A R147B R154A R154B R155A R155B R157A R157B T5A T5B T6A T6B T6E T15A T15B T17
LNsiHPso: not fitted C88 C95 C102 C103 C115 C122 C123B C124B C128A C129A D11B D12A IC25B IC27A IC30 R5 R35 R36 R37 R46 R47 R48 R65 R70 R71 R72 R77 R78 R83A R83B R84A R84B R85A R85B R86A R86B R111 R120 R121 R122 R123 R125B R126B R127B R128B R131A R138 R146A R147A R151B R152B R154A R155A R157A T5A T5B T5E T6A T6B T14B T15A T17
LNsoHPsi: not fitted C88 C95 C102 C103 C115 C122 C123A C124A C128B C129B D11A D12B IC25A IC27B IC30 R5 R38 R39 R40 R43 R44 R45 R65 R69 R71 R72 R73 R76 R83A R83B R84A R84B R85A R85B R86A R86B R112 R120 R121 R122 R123 R125A R126A R127A R128A R131B R137 R146B R147B R151A R152A R154B R155B R157B T5A T5B T6A T6B T6E T14A T15B T16
LNsiHPsi: not fitted C88 C95 C102 C103 C115 C122 C123A C123B C124A C124B D11A D11B IC25A IC25B IC30 R5 R35 R36 R37 R43 R44 R45 R65 R69 R71 R72 R73 R76 R83A R83B R84A R84B R85A R85B R86A R86B R111 R120 R121 R122 R123 R125A R125B R126A R126B R127A R127B R128A R128B R137 R151A R151B R152A R152B T5A T5B T5E T6A T6B T14A T14B T16